# Altium schematic sheet REG_3.3V.SchDoc
size A; SheetNumber: 3; SheetTotal: 7
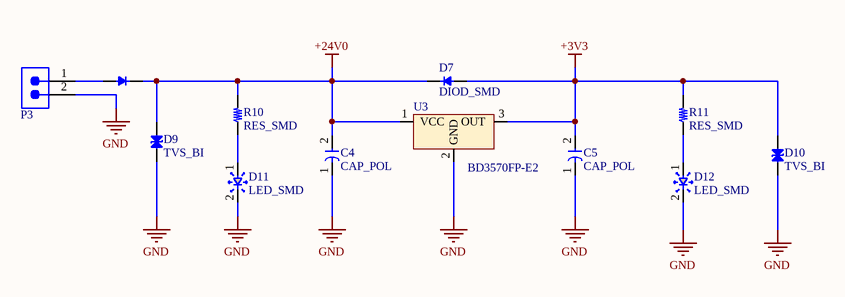
[diagram p0: REG_3.3V.SchDoc]

## Parts
C4  CAP_POL  [CAP_SMC]
C5  CAP_POL  [CAP_SMA]
D7  DIOD_SMD  [DIOD_SMA]
D8  DIOD_SMD  [DIOD_SMA]  (value not drawn)
D9  TVS_BI  [DIOD_SMB]
D10  TVS_BI  [DIOD_SMB]
D11  LED_SMD  [D 0603]
D12  LED_SMD  [D 0603]
P3  691321300002  [691321300002]  (value not drawn)
R10  RES_SMD  [R 0603]
R11  RES_SMD  [R 0603]
U3  BD3570FP-E2  [DPAK-U]

## Nets
+3V3: C5.2 D7.1 D10.2 R11.2 U3.3(OUT)
+24V0: C4.2 D7.2 D8.2 D9.2 R10.2 U3.1(VCC)
GND: C4.1 C5.1 D9.1 D10.1 D11.2 D12.2 P3.2 U3.2(GND)
NetD8_1: D8.1 P3.1
NetD11_1: D11.1 R10.1
NetD12_1: D12.1 R11.1

## Library data of the parts
D9 D10 = DIOD_SMD_TVS_BI
P3 = 691321300002: WR-TBL Series 321 Vertical PCB Header, Through Hole, pitch 3.81mm, 2p; Manufacturer: Wurth Elektronik; Pin Number: 2; Rated Current: 10A; Working Voltage: 300V; Modularity: No; ComponentLink1Description: Manufacturer Link; ComponentLink1URL: https://www.we-online.com/redexpert/article/691321300002?ad; ComponentLink2Description: Datasheet; ComponentLink2URL: https://www.we-online.com/redexpert/spec/691321300002?ad; Category: Terminal Blocks; Match Code: WR-TBL; Manufacturer Part Number: 691321300002; Mount: Through Hole; Operating Temperature Max: 105°C; Operating Temperature Min: -40°C; Packaging: Box; Pitch: 3.81mm; Orientation: Vertical; Application: Pluggable; PCB/Cable/Panel: PCB